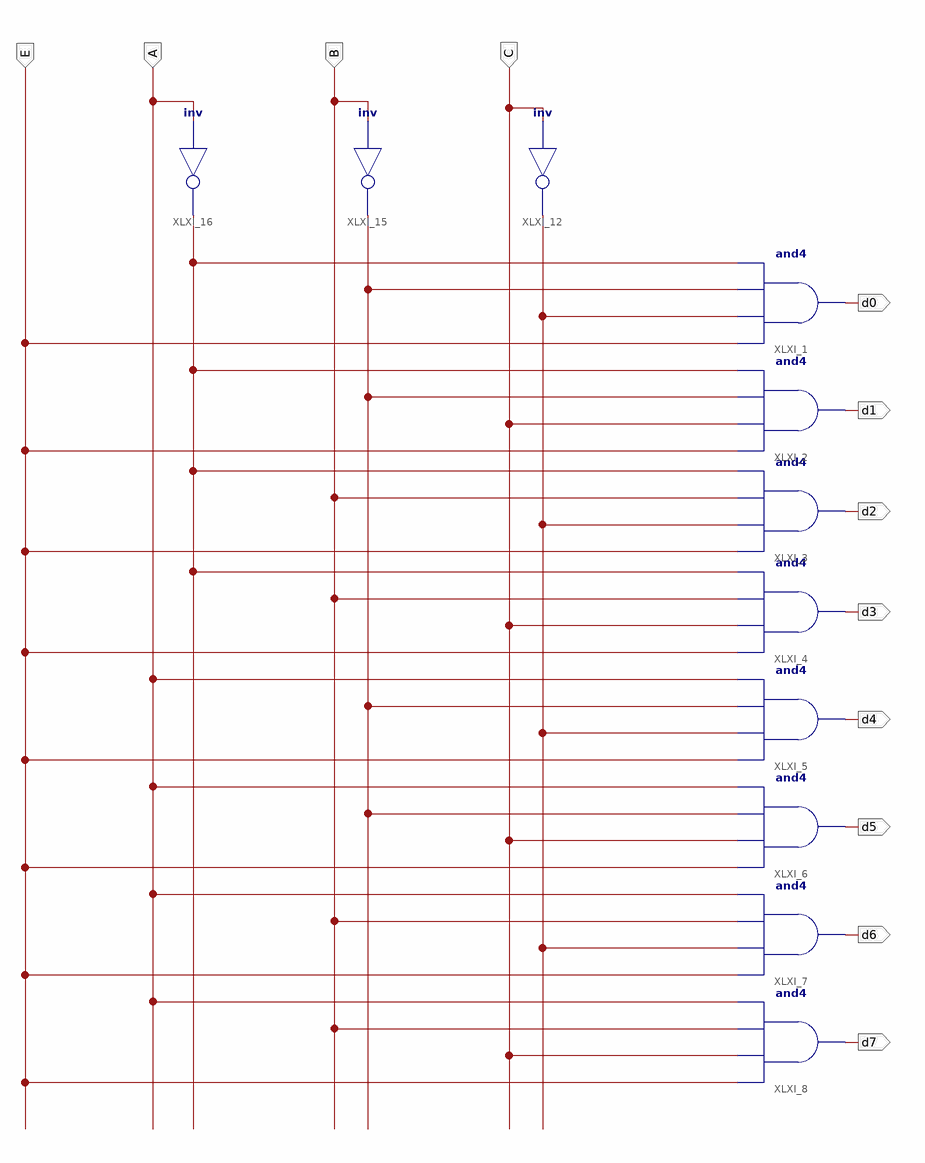
[diagram p0: schematic sheet 1]
// Xilinx ISE schematic sprinkler_circuit.sch (spartan3e) as structural Verilog: 11 symbols, 12 ports
module sprinkler_circuit (
  input  E,
  input  A,
  input  B,
  input  C,
  output d0,
  output d1,
  output d2,
  output d3,
  output d4,
  output d5,
  output d6,
  output d7
);

  wire XLXN_51, XLXN_53, XLXN_54;

  and XLXI_8 (d7, E, C, B, A);
  and XLXI_7 (d6, E, XLXN_51, B, A);
  and XLXI_6 (d5, E, C, XLXN_54, A);
  and XLXI_5 (d4, E, XLXN_51, XLXN_54, A);
  and XLXI_4 (d3, E, C, B, XLXN_53);
  and XLXI_3 (d2, E, XLXN_51, B, XLXN_53);
  and XLXI_2 (d1, E, C, XLXN_54, XLXN_53);
  and XLXI_1 (d0, E, XLXN_51, XLXN_54, XLXN_53);
  not XLXI_12 (XLXN_51, C);
  not XLXI_15 (XLXN_54, B);
  not XLXI_16 (XLXN_53, A);
endmodule
